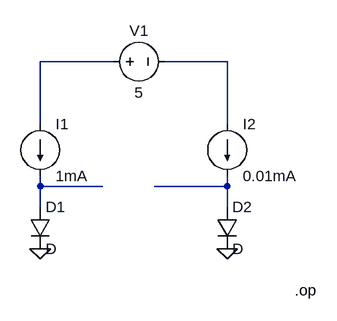
[diagram p0: schematic Draft19.asc]
Draft19.asc, the LTspice schematic file:
Version 4
SHEET 1 880 680
WIRE 272 144 160 144
WIRE 448 144 352 144
WIRE 160 240 160 144
WIRE 448 240 448 144
WIRE 160 336 160 320
WIRE 256 336 160 336
WIRE 448 336 448 320
WIRE 448 336 336 336
WIRE 160 368 160 336
WIRE 448 368 448 336
FLAG 160 432 0
FLAG 448 432 0
SYMBOL current 160 240 R0
SYMATTR InstName I1
SYMATTR Value 1mA
SYMBOL current 448 240 R0
SYMATTR InstName I2
SYMATTR Value 0.01mA
SYMBOL voltage 256 144 R270
WINDOW 0 32 56 VTop 2
WINDOW 3 -32 56 VBottom 2
SYMATTR InstName V1
SYMATTR Value 5
SYMBOL diode 144 368 R0
SYMATTR InstName D1
SYMBOL diode 432 368 R0
SYMATTR InstName D2
TEXT 552 496 Left 2 !.op

The netlist it stands for:
* Draft19.asc
I1 N001 N003 1mA
I2 N002 N004 0.01mA
V1 N001 N002 5
D1 N003 0 D
D2 N004 0 D
.model D D
.lib standard.dio
.op
.backanno
.end